# EAGLE design IFM_DuberFilter_ThroughHole_PCB (EAGLE 9.6.2)
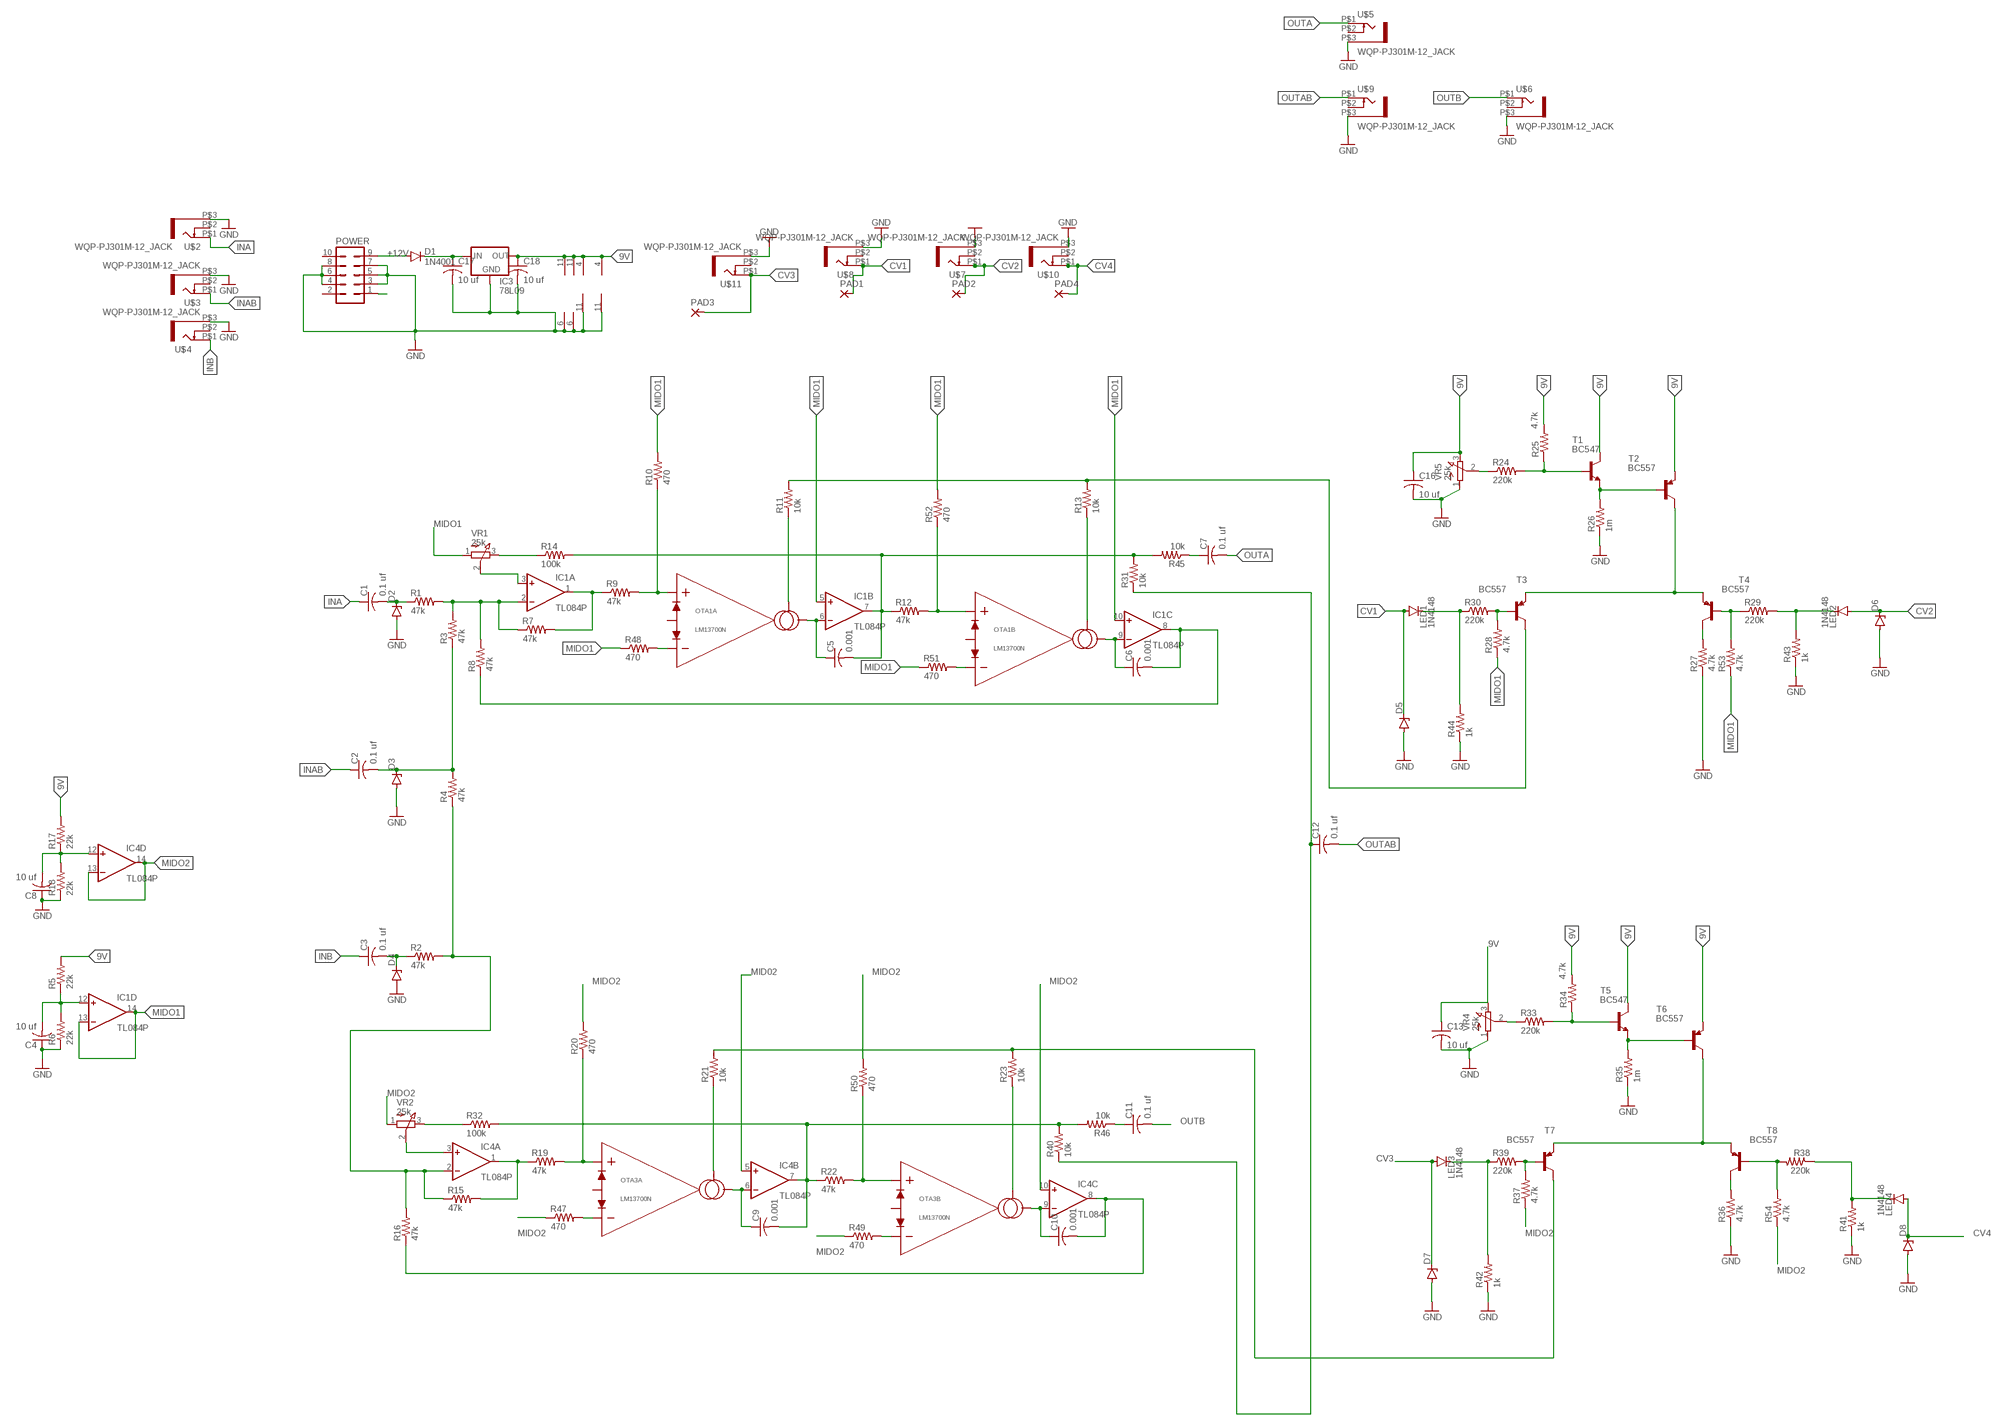
[diagram p0: schematic, sheet 1]

## Parts
C1  0.1 uf  C-US050-030X075  [C050-030X075]
C2  0.1 uf  C-US050-030X075  [C050-030X075]
C3  0.1 uf  C-US050-030X075  [C050-030X075]
C4  10 uf  C-US050-030X075  [C050-030X075]
C5  0.001  C-US050-030X075  [C050-030X075]
C6  0.001  C-US050-030X075  [C050-030X075]
C7  0.1 uf  C-US050-030X075  [C050-030X075]
C8  10 uf  C-US050-030X075  [C050-030X075]
C9  0.001  C-US050-030X075  [C050-030X075]
C10  0.001  C-US050-030X075  [C050-030X075]
C11  0.1 uf  C-US050-030X075  [C050-030X075]
C12  0.1 uf  C-US050-030X075  [C050-030X075]
C13  10 uf  C-US050-030X075  [C050-030X075]
C16  10 uf  C-US050-030X075  [C050-030X075]
C17  10 uf  C-US050-030X075  [C050-030X075]
C18  10 uf  C-US050-030X075  [C050-030X075]
D1  1N4001  1N4004  [DO41-10]
D2  ZENER-DIODEDO34-7  [DO34Z7]
D3  ZENER-DIODEDO34-7  [DO34Z7]
D4  ZENER-DIODEDO34-7  [DO34Z7]
D5  ZENER-DIODEDO34-7  [DO34Z7]
D6  ZENER-DIODEDO34-7  [DO34Z7]
D7  ZENER-DIODEDO34-7  [DO34Z7]
D8  ZENER-DIODEDO34-7  [DO34Z7]
IC1  TL084P  [DIL14]
IC3  78L09  78LXX  [78LXX]
IC4  TL084P  [DIL14]
LED1  1N4148  1N4148DO35-7  [DO35-7]
LED2  1N4148  1N4148DO35-7  [DO35-7]
LED3  1N4148  1N4148DO35-7  [DO35-7]
LED4  1N4148  1N4148DO35-7  [DO35-7]
OTA1  LM13700N  [DIP16]
OTA3  LM13700N  [DIP16]
PAD1  SMD2  [SMD1,27-2,54]
PAD2  SMD2  [SMD1,27-2,54]
PAD3  SMD2  [SMD1,27-2,54]
PAD4  SMD2  [SMD1,27-2,54]
POWER  10_PIN_HEADER  [MA05-2]
R1  47k  R-US_0204/7  [0204/7]
R2  47k  R-US_0204/7  [0204/7]
R3  47k  R-US_0204/7  [0204/7]
R4  47k  R-US_0204/7  [0204/7]
R5  22k  R-US_0204/7  [0204/7]
R6  22k  R-US_0204/7  [0204/7]
R7  47k  R-US_0204/7  [0204/7]
R8  47k  R-US_0204/7  [0204/7]
R9  47k  R-US_0204/7  [0204/7]
R10  470  R-US_0204/7  [0204/7]
R11  10k  R-US_0204/7  [0204/7]
R12  47k  R-US_0204/7  [0204/7]
R13  10k  R-US_0204/7  [0204/7]
R14  100k  R-US_0204/7  [0204/7]
R15  47k  R-US_0204/7  [0204/7]
R16  47k  R-US_0204/7  [0204/7]
R17  22k  R-US_0204/7  [0204/7]
R18  22k  R-US_0204/7  [0204/7]
R19  47k  R-US_0204/7  [0204/7]
R20  470  R-US_0204/7  [0204/7]
R21  10k  R-US_0204/7  [0204/7]
R22  47k  R-US_0204/7  [0204/7]
R23  10k  R-US_0204/7  [0204/7]
R24  220k  R-US_0204/7  [0204/7]
R25  4.7k  R-US_0204/7  [0204/7]
R26  1m  R-US_0204/7  [0204/7]
R27  4.7k  R-US_0204/7  [0204/7]
R28  4.7k  R-US_0204/7  [0204/7]
R29  220k  R-US_0204/7  [0204/7]
R30  220k  R-US_0204/7  [0204/7]
R31  10k  R-US_0204/7  [0204/7]
R32  100k  R-US_0204/7  [0204/7]
R33  220k  R-US_0204/7  [0204/7]
R34  4.7k  R-US_0204/7  [0204/7]
R35  1m  R-US_0204/7  [0204/7]
R36  4.7k  R-US_0204/7  [0204/7]
R37  4.7k  R-US_0204/7  [0204/7]
R38  220k  R-US_0204/7  [0204/7]
R39  220k  R-US_0204/7  [0204/7]
R40  10k  R-US_0204/7  [0204/7]
R41  1k  R-US_0204/7  [0204/7]
R42  1k  R-US_0204/7  [0204/7]
R43  1k  R-US_0204/7  [0204/7]
R44  1k  R-US_0204/7  [0204/7]
R45  10k  R-US_0204/7  [0204/7]
R46  10k  R-US_0204/7  [0204/7]
R47  470  R-US_0204/7  [0204/7]
R48  470  R-US_0204/7  [0204/7]
R49  470  R-US_0204/7  [0204/7]
R50  470  R-US_0204/7  [0204/7]
R51  470  R-US_0204/7  [0204/7]
R52  470  R-US_0204/7  [0204/7]
R53  4.7k  R-US_0204/7  [0204/7]
R54  4.7k  R-US_0204/7  [0204/7]
T1  BC547  [TO92]
T2  BC557  BC557A-PNP-TO92-EBC  [TO92-EBC]
T3  BC557  BC557A-PNP-TO92-EBC  [TO92-EBC]
T4  BC557  BC557A-PNP-TO92-EBC  [TO92-EBC]
T5  BC547  [TO92]
T6  BC557  BC557A-PNP-TO92-EBC  [TO92-EBC]
T7  BC557  BC557A-PNP-TO92-EBC  [TO92-EBC]
T8  BC557  BC557A-PNP-TO92-EBC  [TO92-EBC]
U$2  WQP-PJ301M-12_JACK  [WQP-PJ301M-12_JACK]
U$3  WQP-PJ301M-12_JACK  [WQP-PJ301M-12_JACK]
U$4  WQP-PJ301M-12_JACK  [WQP-PJ301M-12_JACK]
U$5  WQP-PJ301M-12_JACK  [WQP-PJ301M-12_JACK]
U$6  WQP-PJ301M-12_JACK  [WQP-PJ301M-12_JACK]
U$7  WQP-PJ301M-12_JACK  [WQP-PJ301M-12_JACK]
U$8  WQP-PJ301M-12_JACK  [WQP-PJ301M-12_JACK]
U$9  WQP-PJ301M-12_JACK  [WQP-PJ301M-12_JACK]
U$10  WQP-PJ301M-12_JACK  [WQP-PJ301M-12_JACK]
U$11  WQP-PJ301M-12_JACK  [WQP-PJ301M-12_JACK]
VR1  25k  EVUF3L  [EVUFXL]
VR2  25k  EVUF3L  [EVUFXL]
VR4  25k  EVUF3L  [EVUFXL]
VR5  25k  EVUF3L  [EVUFXL]

## Nets
9V: C13.1 C16.1 C18.1 IC1.4(P:V+) IC3.OUT IC4.4(P:V+) OTA1.11(PWR:VCC) OTA3.11(PWR:VCC) R5.2 R17.2 R25.2 R34.2 T1.3(C) T2.E T5.3(C) T6.E VR4.3(E) VR5.3(E)
+12V [power]: C17.1 D1.C IC3.IN
-12V [power]: POWER.1
CV1: D5.C LED1.A PAD1.1(P) U$8.P$1
CV2: D6.C LED2.A PAD2.1(P) U$7.P$1
CV3: D7.C LED3.A PAD3.1(P) U$11.P$1
CV4: D8.C LED4.A PAD4.1(P) U$10.P$1
GND: C4.1 C8.1 C13.2 C16.2 C17.2 C18.2 D2.A D3.A D4.A D5.A D6.A D7.A D8.A IC1.11(P:V-) IC3.GND IC4.11(P:V-) OTA1.6(PWR:VEE) OTA3.6(PWR:VEE) POWER.3 POWER.4 POWER.5 POWER.6 POWER.7 POWER.8 R6.1 R18.1 R26.1 R27.1 R35.1 R36.1 R41.1 R42.1 R43.1 R44.1 U$2.P$3 U$3.P$3 U$4.P$3 U$5.P$3 U$6.P$3 U$7.P$3 U$8.P$3 U$9.P$3 U$10.P$3 U$11.P$3 VR4.1(A) VR5.1(A)
INA: C1.1 U$2.P$1
INAB: C2.1 U$3.P$1
INB: C3.1 U$4.P$1
MID02: IC4.5(B:+IN)
MIDO1: IC1.5(B:+IN) IC1.10(C:+IN) IC1.13(D:-IN) IC1.14(D:OUT) R10.2 R28.1 R48.1 R51.1 R52.2 R53.1 VR1.1(A)
MIDO2: IC4.10(C:+IN) IC4.13(D:-IN) IC4.14(D:OUT) R20.2 R37.1 R47.1 R49.1 R50.2 R54.1 VR2.1(A)
N$1: C3.2 D4.C R2.1
N$2: C1.2 D2.C R1.1
N$3: C2.2 D3.C R3.1 R4.2
N$4: IC4.2(A:-IN) R2.2 R4.1 R15.1 R16.2
N$5: IC1.2(A:-IN) R1.2 R3.2 R7.1 R8.2
N$6: OTA1.16(B:IABC) R13.1
N$7: C4.2 IC1.12(D:+IN) R5.1 R6.2
N$8: R14.1 VR1.3(E)
N$9: OTA1.13(B:IN-) R51.2
N$10: IC4.1(A:OUT) R15.2 R19.1
N$11: IC1.1(A:OUT) R7.2 R9.1
N$12: OTA1.3(A:IN+) R9.2 R10.1
N$13: C5.1 IC1.6(B:-IN) OTA1.5(A:IOUT)
N$14: OTA1.1(A:IABC) R11.1
N$15: C5.2 IC1.7(B:OUT) R12.1 R14.2 R31.2 R45.2
N$16: R29.1 R53.2 T4.B
N$17: R11.2 R13.2 T3.C
N$18: C6.1 IC1.9(C:-IN) OTA1.12(B:IOUT)
N$19: C6.2 IC1.8(C:OUT) R8.1
N$20: IC1.3(A:+IN) VR1.2(S)
N$21: R24.1 VR5.2(S)
N$22: OTA1.14(B:IN+) R12.2 R52.1
N$23: OTA3.3(A:IN+) R19.2 R20.1
N$24: C8.2 IC4.12(D:+IN) R17.1 R18.2
N$25: C9.1 IC4.6(B:-IN) OTA3.5(A:IOUT)
N$26: OTA3.1(A:IABC) R21.1
N$27: C9.2 IC4.7(B:OUT) R22.1 R32.2 R40.2 R46.2
N$28: OTA3.16(B:IABC) R23.1
N$29: R21.2 R23.2 T7.C
N$30: R32.1 VR2.3(E)
N$31: C10.1 IC4.9(C:-IN) OTA3.12(B:IOUT)
N$32: C10.2 IC4.8(C:OUT) R16.1
N$33: D1.A POWER.9
N$34: IC4.3(A:+IN) VR2.2(S)
N$35: OTA1.4(A:IN-) R48.2
N$36: R33.2 R34.1 T5.2(B)
N$37: R33.1 VR4.2(S)
N$38: R24.2 R25.1 T1.2(B)
N$39: LED2.C R29.2 R43.2
N$40: R26.2 T1.1(E) T2.B
N$41: T2.C T3.E T4.E
N$42: R35.2 T5.1(E) T6.B
N$43: R27.2 T4.C
N$44: C12.1 R31.1 R40.1
N$45: R28.2 R30.2 T3.B
N$47: C11.1 R46.1
N$49: LED1.C R30.1 R44.2
N$50: T6.C T7.E T8.E
N$51: R36.2 T8.C
N$52: R38.2 R54.2 T8.B
N$53: R37.2 R39.2 T7.B
N$54: LED4.C R38.1 R41.2
N$55: OTA3.4(A:IN-) R47.2
N$56: OTA3.13(B:IN-) R49.2
N$57: OTA3.14(B:IN+) R22.2 R50.1
N$58: LED3.C R39.1 R42.2
N$66: C7.1 R45.1
OUTA: C7.2 U$5.P$1
OUTAB: C12.2 U$9.P$1
OUTB: C11.2 U$6.P$1
Unconnected: OTA1.2(A:BIAS) OTA1.7(BUFA:IN) OTA1.8(BUFA:OUT) OTA1.9(BUFB:OUT) OTA1.10(BUFB:IN) OTA1.15(B:BIAS) OTA3.2(A:BIAS) OTA3.7(BUFA:IN) OTA3.8(BUFA:OUT) OTA3.9(BUFB:OUT) OTA3.10(BUFB:IN) OTA3.15(B:BIAS) POWER.2 POWER.10 U$2.P$2 U$3.P$2 U$4.P$2 U$5.P$2 U$6.P$2 U$7.P$2 U$8.P$2 U$9.P$2 U$10.P$2 U$11.P$2

## Library data of the parts
C1-C13 C16-C18 = rcl:C-US: CAPACITOR, American symbol; SPICEPREFIX: C
D1 = diode:1N4004: DIODE general purpose rectifier, 1 A
D2 D4-D8 = diode:ZENER-DIODE: Z-Diode
D3 = diode:ZENER-DIODE: Z-Diode; SPICEPREFIX: D
IC1 IC4 = linear:TL084: OP AMP
IC3 = v-reg:78LXX: VOLTAGE REGULATOR
LED1 LED3 = diode:1N4148: DIODE high speed (Philips); SPICEPREFIX: L
LED2 LED4 = diode:1N4148: DIODE high speed (Philips)
OTA1 OTA3 = OTAs:LM13700: Dual OTA with linearizing diode and output buffers - 2MHz open-loop bandwidth - Linearizing diodes reduces distortion at higher differential input voltages - Darlington output buffers enables low-impedance output LM13700 or LM13600 The LM13700 differs from the LM13600 in that the 13700's output buffers are biased independently from the transconductance amplifier, allowing superior performance in audio applications. Originally released by National Semiconductor Manufactured by Texas Instruments.
PAD1-PAD4 = wirepad:SMD2: SMD PAD
POWER = TomW:10_PIN_HEADER: PIN HEADER; OC_FARNELL: unknown; OC_NEWARK: unknown
R1-R54 = rcl:R-US_: RESISTOR, American symbol; SPICEPREFIX: R
T1 T5 = transistor:BC547: NPN TRANSISTOR
T2-T4 T6-T8 = transistor:*-PNP-: PNP Transistror
U$2-U$11 = thonkiconn:WQP-PJ301M-12_JACK
VR1 VR2 VR4 VR5 = pot:EVU: 9 mm Square Rotary Potentiometers Source: Panasonic

## Net classes
1 power: width 0.61 mm

## Board
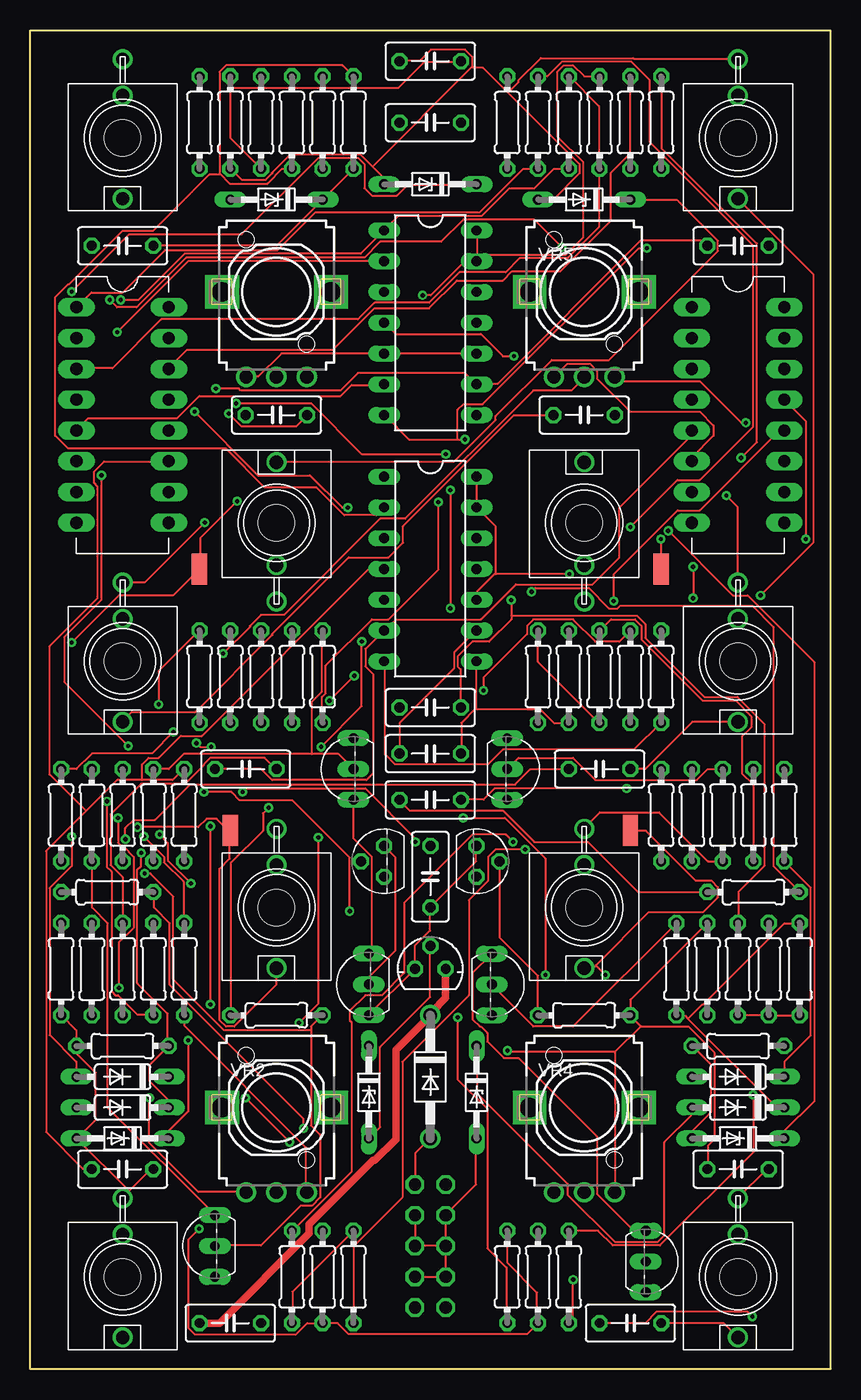
[diagram p1: board, top side]
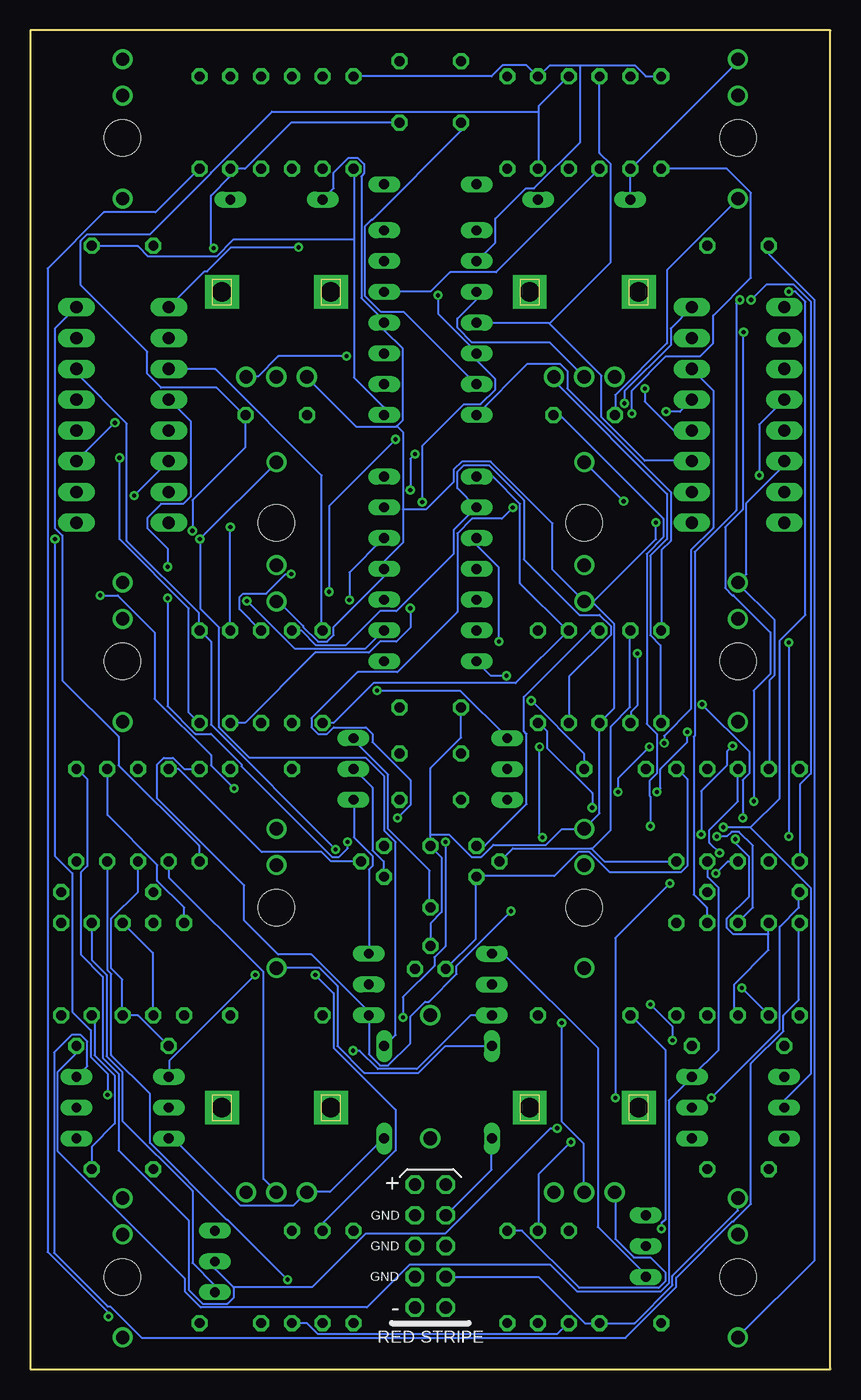
[diagram p2: board, bottom side, seen from below]

Size 66.04 x 110.49 mm. Coordinates in mm from the lower left corner, seen from the top.
Outline: 0,110.49 66.04,110.49 66.04,0 0,0 0,110.49
Copper layers (1*16): Top 0.035mm / dielectric 1.5mm / Bottom 0.035mm
Design rules "default": minimum track width 6mil, minimum drill 0.35mm, track to track 6mil, track to pad 6mil, pad to pad 6mil, via to via 6mil, smd to smd 6mil, copper to edge 40mil, drill to drill 6mil, minimum pad ring 10mil, minimum via ring 8mil, stop-mask expansion 4mil, vias tented up to drill 0mil, thermal gap 10mil
Holes 3 mm at 7.62,101.6 20.32,69.85 7.62,7.62 7.62,58.42 20.32,38.1 45.72,69.85 45.72,38.1 58.42,7.62 58.42,58.42 58.42,101.6

### Footprints (pad centres in the part's own frame; a part is rotated, then mirrored left to right if it is on the bottom)
C050-030X075 = drill 0.813 octagon: 1 -2.54,0; 2 2.54,0
DO41-10 = drill 1.118: A 5.08,0; C -5.08,0
DO34Z7 = drill 0.813 long: A 3.81,0; C -3.81,0
DIL14 = drill 0.813 long: 1 -7.62,-3.81; 2 -5.08,-3.81; 3 -2.54,-3.81; 4 0,-3.81; 5 2.54,-3.81; 6 5.08,-3.81; 7 7.62,-3.81; 8 7.62,3.81; 9 5.08,3.81; 10 2.54,3.81; 11 0,3.81; 12 -2.54,3.81; 13 -5.08,3.81; 14 -7.62,3.81
78LXX = drill 0.813 octagon: GND 0,1.905; IN 1.27,0; OUT -1.27,0
DO35-7 = drill 0.813 long: A 3.81,0; C -3.81,0
DIP16 = drill 1 long: 1 -3.81,0; 2 -3.81,-2.54; 3 -3.81,-5.08; 4 -3.81,-7.62; 5 -3.81,-10.16; 6 -3.81,-12.7; 7 -3.81,-15.24; 8 -3.81,-17.78; 9 3.81,-17.78; 10 3.81,-15.24; 11 3.81,-12.7; 12 3.81,-10.16; 13 3.81,-7.62; 14 3.81,-5.08; 15 3.81,-2.54; 16 3.81,0
SMD1,27-2,54 = smd 1.27 x 2.54: 1 0,0
MA05-2 = drill 1.016 octagon: 1 -5.08,-1.27; 2 -5.08,1.27; 3 -2.54,-1.27; 4 -2.54,1.27; 5 0,-1.27; 6 0,1.27; 7 2.54,-1.27; 8 2.54,1.27; 9 5.08,-1.27; 10 5.08,1.27
0204/7 = drill 0.813 octagon: 1 -3.81,0; 2 3.81,0
TO92 = drill 0.813 octagon: 1 1.27,0; 2 0,1.905; 3 -1.27,0
TO92-EBC = drill 0.813 long: B 0,-1.27; C 2.54,-1.27; E -2.54,-1.27
WQP-PJ301M-12_JACK = drill 1.1: P$1 0,5; P$2 0,-3.5; P$3 0,-6.5
EVUFXL = drill 1.1 pad 1.676: 1 -2.5,-7; 2 0,-7; 3 2.5,-7 | drill 1.6 pad 2.8 square: M1 4.5,0; M2 -4.5,0

### Placement (x,y rotation side)
C1  20.32,78.74 0 top
C2  45.72,78.74 0 top
C3  7.62,92.71 0 top
C4  33.02,107.95 0 top
C5  33.02,102.87 0 top
C6  58.42,92.71 0 top
C7  33.02,46.99 0 top
C8  33.02,54.61 0 top
C9  17.78,49.53 0 top
C10  33.02,50.8 0 top
C11  49.53,3.81 0 top
C12  46.99,49.53 0 top
C13  58.42,16.51 0 top
C16  7.62,16.51 0 top
C17  16.51,3.81 0 top
C18  33.02,40.64 90 top
D1  33.02,24.13 270 top
D2  7.62,19.05 180 top
D3  58.42,19.05 180 top
D4  20.32,96.52 180 top
D5  45.72,96.52 180 top
D6  33.02,97.79 180 top
D7  36.83,22.86 270 top
D8  27.94,22.86 270 top
IC1  33.02,86.36 270 top
IC3  33.02,33.02 0 top
IC4  33.02,66.04 270 top
LED1  7.62,24.13 180 top
LED2  7.62,21.59 180 top
LED3  58.42,21.59 180 top
LED4  58.42,24.13 180 top
OTA1  7.62,87.63 0 top
OTA3  58.42,87.63 0 top
PAD1  13.97,66.04 0 top
PAD2  16.51,44.45 0 top
PAD3  52.07,66.04 0 top
PAD4  49.53,44.45 0 top
POWER  33.02,10.16 90 bottom
R1  13.97,102.87 90 top
R2  26.67,102.87 90 top
R3  24.13,102.87 90 top
R4  21.59,102.87 90 top
R5  19.05,102.87 90 top
R6  16.51,102.87 90 top
R7  10.16,33.02 90 top
R8  39.37,102.87 90 top
R9  44.45,102.87 90 top
R10  46.99,102.87 90 top
R11  41.91,102.87 90 top
R12  49.53,102.87 90 top
R13  49.53,57.15 90 top
R14  13.97,57.15 90 top
R15  21.59,57.15 90 top
R16  44.45,57.15 90 top
R17  55.88,33.02 90 top
R18  58.42,33.02 90 top
R19  41.91,57.15 90 top
R20  46.99,57.15 90 top
R21  2.54,45.72 90 top
R22  52.07,57.15 90 top
R23  52.07,45.72 90 top
R24  16.51,57.15 90 top
R25  12.7,45.72 90 top
R26  19.05,57.15 90 top
R27  5.08,45.72 270 top
R28  24.13,57.15 90 top
R29  7.62,45.72 90 top
R30  10.16,45.72 90 top
R31  5.08,33.02 270 top
R32  12.7,33.02 90 top
R33  54.61,45.72 90 top
R34  45.72,29.21 0 top
R35  57.15,45.72 90 top
R36  60.96,33.02 90 top
R37  59.69,45.72 90 top
R38  62.23,45.72 90 top
R39  53.34,33.02 90 top
R40  7.62,33.02 90 top
R41  2.54,33.02 90 top
R42  63.5,33.02 90 top
R43  7.62,26.67 0 top
R44  58.42,26.67 0 top
R45  59.69,39.37 0 top
R46  52.07,102.87 90 top
R47  21.59,7.62 90 top
R48  24.13,7.62 90 top
R49  44.45,7.62 90 top
R50  26.67,7.62 90 top
R51  41.91,7.62 90 top
R52  39.37,7.62 90 top
R53  20.32,29.21 0 top
R54  6.35,39.37 0 top
T1  29.21,41.91 90 top
T2  26.67,31.75 90 top
T3  25.4,49.53 90 top
T4  13.97,10.16 90 top
T5  36.83,41.91 270 top
T6  40.64,49.53 270 top
T7  39.37,31.75 270 top
T8  52.07,8.89 270 top
U$2  7.62,101.6 180 top
U$3  7.62,58.42 180 top
U$4  7.62,7.62 180 top
U$5  58.42,101.6 180 top
U$6  58.42,7.62 180 top
U$7  20.32,38.1 180 top
U$8  20.32,69.85 0 top
U$9  58.42,58.42 180 top
U$10  45.72,38.1 180 top
U$11  45.72,69.85 0 top
VR1  20.32,88.9 0 top
VR2  20.32,21.59 0 top
VR4  45.72,21.59 0 top
VR5  45.72,88.9 0 top

### Tracks (layer width: path | path; a pad name or v marks a point on that pad's centre or on a via)
9V  (via drill 0.35)
  Top 0.152: v59.05,78.11 58.67,78.11 55.24,81.53 48.54,81.53 48.23,81.84 VR5.3 | v39.93,83.59 39.01,83.59 37.19,85.42 30.18,85.42 29.26,86.33 IC1.4 | R17.2 49.53,30.48 R34.2 49.53,29.18 50.41,28.31 | 50.41,28.31 50.44,28.27 54.33,28.27 56.46,26.14 56.46,18.97 55.93,18.44 55.93,16.54 C13.1 | 50.41,28.31 48.27,26.18 | 48.27,26.18 48.23,26.14 48.23,14.63 VR4.3 | T2.E 27.96,29.26 31.7,32.99 IC3.OUT 31.77,33.07 31.77,34.98 32.99,36.2 32.99,38.1 | 32.99,38.1 36.8,41.91 36.8,43.13 T5.3 | 32.99,38.1 C18.1 | v39.4,26.29 39.47,26.21 48.23,26.21 48.27,26.18 | 4.61,46.06 7.16,48.62 9.22,48.62 | 4.61,46.06 1.29,42.75 1.29,19.58 4.34,16.54 5.03,16.54 C16.1 | 9.22,48.62 11.73,48.62 12.65,49.53 R25.2 | 9.22,48.62 9.22,49.91 9.75,50.44 10.59,50.44 12.42,52.27 14.17,52.27 27.89,65.99 29.18,65.99 IC4.4 | 4.61,46.06 1.6,49.07 1.6,59.66 5.56,63.63 5.56,72.85 5.26,73.15 5.26,74.07 6.1,74.91 11.43,74.91 OTA1.11
  Bottom 0.152: v59.05,78.11 OTA3.11 | 23.2,86.3 18.9,81.99 18.9,78.56 15.32,74.98 11.43,74.98 OTA1.11 | 23.2,86.3 23.24,86.33 29.18,86.33 IC1.4 | R5.2 19.05,100.36 18.14,99.44 18.14,91.36 23.2,86.3 | v39.93,83.59 45.57,83.59 47.24,81.92 48.16,81.92 VR5.3 | IC3.OUT 29.26,35.51 29.26,40.62 T1.3 29.18,40.69 22.78,40.69 20.8,42.67 19.89,42.67 18.21,41 12.34,41 11.81,41.53 11.81,48.69 12.65,49.53 R25.2 | T6.E 39.32,52.05 39.32,51.89 36.5,49.07 36.5,44.58 33.07,41.15 33.07,38.1 C18.1 | v39.4,26.29 38.86,26.29 37.34,24.77 34.14,24.77 29.72,29.18 27.96,29.18 T2.E
+12V
  Top 0.61: C17.1 15.62,3.81 23.01,11.2 23.01,11.96 28.27,17.22 28.42,17.22 30.18,18.97 30.18,26.36 D1.C 33.15,29.49 34.29,30.63 IC3.IN
CV1  (via drill 0.35)
  Top 0.152: v17.07,71.63 14.02,68.58 14.02,66.06 PAD1.1 13.95,65.99 11.81,63.86 7.32,63.86 v3.43,59.97 | LED1.A 3.81,25.38 1.6,27.58 1.6,39.7 3.43,41.53 v3.43,43.97 | D5.C 49.53,96.47 53.42,96.47 56.77,93.12 56.77,92.28 47.78,83.29 43.05,83.29 38.41,78.64 38.41,78.33 34.98,74.91 20.34,74.91 U$8.P$1
  Bottom 0.152: v17.07,71.63 20.27,74.83 U$8.P$1 | v3.43,59.97 v3.43,43.97
CV2  (via drill 0.35)
  Top 0.152: U$7.P$1 20.27,33.07 20.27,31.7 16.84,28.27 16.15,28.27 15.62,28.8 15.62,41.3 16.46,42.14 16.46,44.42 PAD2.1 16.38,44.42 15.39,45.41 14.55,45.41 13.87,44.73 v8.84,44.73 | v3.43,88.92 8.15,93.65 17.45,93.65 23.77,99.97 27.05,99.97 27.58,99.44 27.58,97.46 28.19,96.85 30.25,96.85 31.17,97.77 36.8,97.77 D6.C
  Bottom 0.152: LED2.A 3.81,22.17 1.6,24.38 1.6,39.7 6.59,44.69 | 6.59,44.69 6.63,44.73 v8.84,44.73 | v3.43,88.92 2.9,88.92 2.06,88.09 2.06,62.26 4.19,60.12 4.19,47.09 6.59,44.69
CV3  (via drill 0.35)
  Top 0.152: v52.05,68.5 52.05,66.06 PAD3.1 | LED3.A 54.56,21.57 54.56,20.95 52.35,18.75 52.35,11.05 51.82,10.52 48.23,10.52 44.35,14.4 44.35,15.32 36.88,22.78 36.88,26.67 D7.C
  Bottom 0.152: U$11.P$1 45.72,74.83 v52.05,68.5 51.97,68.5 51.97,62.71 50.44,61.19 50.44,52.96 47.93,50.44 38.33,50.44 36.8,48.92 36.8,44.42 35.89,43.51 35.89,27.58 36.8,26.67 D7.C
CV4  (via drill 0.35)
  Top 0.152: 46.67,33.34 46.48,33.15 45.72,33.15 U$10.P$1 | 46.67,33.34 51.05,37.72 55.55,37.72 56.77,38.94 56.77,39.78 56.24,40.31 54.94,40.31 50.83,44.42 49.53,44.42 PAD4.1 | 46.67,33.34 v47.47,32.54
  Bottom 0.152: v47.47,32.54 54.56,25.45 54.56,24.16 LED4.A | D8.C 31.77,26.67 33.98,24.46 38.48,24.46 40.69,26.67 40.69,31.62 42.22,33.15 45.72,33.15 U$10.P$1
GND  (via drill 0.35)
  Top 0.152: OTA3.6 54.63,74.98 54.63,75.29 56.39,77.04 56.39,77.88 55.24,79.02 49.53,79.02 46.79,81.76 46.79,82.37 46.18,82.98 44.35,82.98 43.28,81.92 VR5.1 | v57.45,72.08 58.37,71.17 58.37,64.92 U$9.P$3 | 28.23,99.25 27.2,100.28 21.49,100.28 19.96,98.75 19.96,98.68 19.43,98.15 17.45,98.15 16.54,99.06 R6.1 | 28.23,99.25 29.18,98.3 29.18,97.84 D6.A | 28.23,99.25 36.46,107.48 | 36.46,107.48 36.5,107.52 36.5,108.28 35.89,108.89 33.07,108.89 32.16,107.97 30.48,107.97 C4.1 | 39.43,105.35 37.34,107.44 36.5,107.44 36.46,107.48 | 39.43,105.35 45.34,99.44 45.34,98.68 43.2,96.55 41.91,96.55 D5.A | 39.43,105.35 40.31,106.22 40.31,106.38 42.14,108.2 49.76,108.2 49.84,108.13 58.37,108.13 U$5.P$3 | v14.4,69.88 9.45,64.92 U$3.P$3 | R35.1 55.93,41.91 51.89,45.95 47.02,45.95 45.72,44.65 U$10.P$3 | C13.2 60.96,16.46 60.73,16.46 58.45,14.17 U$6.P$3 | 60.96,29.18 58.45,29.18 R18.1 | 60.96,29.18 63.48,29.18 R42.1 | 60.96,29.18 R36.1 | D3.A 54.63,19.05 54.63,19.66 56.16,21.18 56.16,25.15 54.63,26.67 R44.1 | R41.1 2.59,29.18 3.81,27.96 R43.1 3.81,26.06 5.41,24.46 5.41,20.57 3.89,19.05 D2.A 8.15,14.71 | 8.15,14.71 7.62,14.17 U$4.P$3 8.15,14.71 | 8.15,14.71 9.91,16.46 10.13,16.46 C16.2 | POWER.3 POWER.4 POWER.6 34.29,10.21 | POWER.7 31.77,12.65 31.77,10.21 POWER.5 31.85,10.21 34.29,10.21 | D7.A 36.8,19.05 36.8,15.24 34.29,12.72 POWER.8 34.29,10.21 | IC3.GND 32.99,34.9 32.99,30.71 28.88,26.59 28.88,19.96 27.96,19.05 D8.A
  Bottom 0.152: U$11.P$3 45.72,63.32 45.49,63.32 43.51,61.34 43.51,61.27 42.29,60.05 41.53,60.05 41,60.58 41,61.27 36.88,65.38 36.88,65.99 IC4.11 36.8,66.06 36.8,66.67 35.28,68.2 35.28,70.94 | 35.78,77.84 35.81,77.8 39.17,77.8 43.2,81.84 VR5.1 | 35.78,77.84 35.28,78.33 35.28,84.2 36.8,85.72 36.8,86.33 IC1.11 36.88,86.41 36.88,86.56 38.71,88.39 38.71,98.45 38.48,98.68 38.48,99.44 39.01,99.97 39.78,99.97 41,98.75 41,97.46 41.91,96.55 D5.A | OTA3.6 v57.45,72.08 | 35.28,70.94 35.28,77.34 35.78,77.84 | D4.A 16.54,96.55 16.54,99.06 R6.1 16.46,99.06 7.62,107.9 U$2.P$3 | R27.1 5.03,49.53 5.03,56.84 4.65,57.23 4.65,61.87 7.62,64.85 U$3.P$3 6.93,65.61 6.93,71.48 3.81,74.6 OTA1.6 | U$8.P$3 20.27,63.32 19.66,63.32 17.83,61.49 17.83,54.56 R26.1 19.05,45.87 20.27,44.65 U$7.P$3 20.34,44.58 22.17,44.58 23.47,43.28 27.81,43.28 28.8,42.29 29.64,42.29 31.47,44.12 32.99,44.12 | IC3.GND 32.99,34.98 32.99,36.8 32.08,37.72 32.08,42.22 32.99,43.13 C18.2 32.99,43.2 32.99,44.12 | C8.1 30.48,52.12 32.99,49.61 32.99,44.12 | v14.4,69.88 14.4,68.5 19.58,63.32 U$8.P$3 | R44.1 54.63,26.67 57.15,29.18 58.37,29.18 R18.1 58.45,29.26 58.45,32.16 59.36,33.07 59.36,37.19 57.15,39.4 R35.1 | C13.2 60.96,18.36 59.05,20.27 59.05,24.23 60.73,25.91 60.73,28.96 60.96,29.18 R36.1 | POWER.3 24.08,7.62 20.27,3.81 C17.2 16.15,3.81 13.03,6.93 13.03,7.7 7.62,13.11 U$4.P$3 | D8.A 27.96,19.05 27.96,16.46 31.7,12.72 POWER.7 | D7.A 36.88,19.05 41.3,14.63 43.2,14.63 VR4.1 43.28,14.55 44.35,13.49 48.69,13.49 54.25,19.05 D3.A | 35.28,70.94 33.38,70.94 31.09,73.23 31.09,74.22 30.4,74.91 28.04,74.91 22.94,69.8 22.94,65.99 20.34,63.4 U$8.P$3
INA
  Bottom 0.152: C1.1 17.75,78.79 17.75,80.39 13.49,84.66 13.49,90.68 7.62,96.55 U$2.P$1
INAB
  Top 0.152: C2.1 43.13,78.72 39.93,78.72 30.79,69.57 30.79,68.2 29.57,66.98 26.29,66.98 19.96,60.66 19.96,60.58 13.64,54.25 8.38,54.25 7.62,53.49 U$3.P$1
INB
  Bottom 0.152: C3.1 5.03,92.66 5.03,91.97 1.29,88.24 1.29,8.99 7.62,2.67 U$4.P$1
MIDO1  (via drill 0.35)
  Top 0.152: IC1.10 IC1.5 20.73,83.82 18.82,81.92 17.83,81.92 VR1.1 | 36.88,91.97 36.88,93.95 IC1.14 | 36.88,91.97 36.88,91.44 IC1.13 | R10.2 45.72,106.68 44.81,107.59 44.04,107.59 43.51,107.06 43.51,101.73 45.64,99.59 45.64,93.42 44.2,91.97 36.88,91.97 | 36.88,91.97 IC1.13 | v32.38,88.62 33.07,88.62 35.89,91.44 IC1.13 | R52.2 39.4,11.43 39.4,8.76 41.83,6.33 41.83,3.81 R51.1 41,2.9 26.29,2.9 25.38,3.81 R48.1 22.86,3.81 21.95,2.9 13.56,2.9 13.03,3.43 13.03,10.67 v13.95,11.58 | v19.66,46.33 19.2,45.87 19.2,44.42 16.54,41.76 16.54,29.26 R53.1 | v33.68,71.55 33.68,65.99 29.57,61.87 28.19,61.87 24.38,58.06 24.38,55.78 24.08,55.47 24.08,53.34 R28.1
  Bottom 0.152: v32.38,88.62 32.38,87.1 29.26,83.97 29.26,83.82 IC1.5 29.18,83.82 29.18,83.21 27.66,81.69 27.66,80.85 28.88,79.63 30.25,79.63 33.68,76.2 v33.68,71.55 | v19.66,46.33 19.66,47.55 23.39,51.28 23.39,52.65 24.08,53.34 R28.1 | v13.95,11.58 13.95,12.04 13.64,12.34 13.64,26.36 16.46,29.18 R53.1
MIDO2  (via drill 0.35)
  Top 0.152: 38.37,65.65 38.41,65.68 38.41,69.57 36.88,71.09 IC4.13 36.88,71.17 36.88,73.61 IC4.14 | 38.37,65.65 36.88,64.16 36.88,63.55 IC4.10 | R37.1 59.66,41.91 59.66,48.23 58.75,49.15 58.75,52.2 59.51,52.96 59.51,53.87 58.22,55.17 55.47,55.17 50.44,60.2 50.44,61.34 49.91,61.87 47.93,61.87 47.02,60.96 R20.2 | v44.5,65.61 38.41,65.61 38.37,65.65 | R50.2 21.64,6.4 21.64,3.81 R47.1 | v9.83,22.4 9.83,18.67 13.87,14.63 17.75,14.63 VR2.1 | v44.81,7.39 44.81,4.12 44.5,3.81 R49.1
  Bottom 0.152: v44.5,65.61 44.96,65.61 46.56,64.01 48.46,64.01 48.77,63.7 48.77,62.71 47.02,60.96 R20.2 | R49.1 43.2,3.81 42.29,2.9 22.55,2.9 21.64,3.81 R47.1 | v9.83,22.4 4.19,28.04 4.19,36.5 2.59,38.1 2.59,39.32 R54.1 | R50.2 25.45,11.43 20.73,6.71 14.17,6.71 13.64,7.24 13.64,8 14.86,9.22 16.23,9.22 17.75,10.74 17.75,14.55 VR2.1 | v44.81,7.39 49.76,12.34 49.84,12.34 56.16,18.67 56.16,22.71 59.36,25.91 59.36,32.61 59.66,32.92 59.66,41.91 R37.1
N$1
  Top 0.152: C3.2 10.21,92.73 20.34,92.73 D4.C R2.1
N$2  (via drill 0.35)
  Top 0.152: D2.C 11.43,19.66 13.03,21.26 v13.03,27.13 | v14.86,44.81 v14.86,30.1 | v16.38,78.87 17.45,77.8 21.95,77.8 22.86,78.72 C1.2
  Bottom 0.152: v13.03,27.13 13.03,28.27 v14.86,30.1 | v14.86,44.81 14.86,47.24 14.94,47.32 14.94,48.54 14.33,49.15 14.33,52.43 15.16,53.26 15.16,67.28 13.79,68.66 13.79,70.18 22.33,78.72 22.86,78.72 C1.2 | R1.1 8.53,99.06 6.55,97.08 6.55,90.07 9.68,86.94 9.68,84.66 10.74,83.59 13.56,83.59 16.38,80.77 v16.38,78.87
N$3  (via drill 0.35)
  Top 0.152: v52.65,69.19 57.99,63.86 59.21,63.86 64.69,58.37 64.69,22.1 62.26,19.66 62.26,19.05 D3.C
  Bottom 0.152: 24.08,103.78 24.08,104.24 21.64,106.68 R4.2 | 24.08,103.78 24.08,99.06 R3.1 | v52.65,69.19 52.65,71.7 48.31,76.05 48.31,78.72 C2.2 48.39,78.72 50.67,81 55.24,81 56.39,82.14 56.39,83.97 61.87,89.46 61.87,93.12 61.34,93.65 56.16,93.65 51.13,98.68 51.13,98.75 46.1,103.78 24.08,103.78
N$4
  Top 0.152: R4.1 20.8,99.06 19.58,97.84 16.46,97.84 15.66,98.64 | 15.66,98.64 15.62,98.68 15.62,107.06 16.15,107.59 25.76,107.59 R2.2 | IC4.2 28.57,70.48 25.91,70.48 23.62,72.77 19.36,72.77 16.15,75.97 3.12,75.97 2.06,77.04 2.06,88.47 3.12,89.53 3.2,89.53 7.62,93.95 10.13,93.95 14.78,98.6 15.62,98.6 15.66,98.64
  Bottom 0.152: R15.1 21.57,53.34 21.57,57.15 18.14,60.58 18.14,61.34 19.05,62.26 20.73,62.26 25.3,66.83 25.3,71.7 28.19,74.6 30.25,74.6 30.79,74.07 30.79,72.69 IC4.2 29.26,71.09 31.09,69.27 31.09,67.28 35.81,62.56 37.19,62.56 40.01,59.74 42.44,59.74 43.66,60.96 R16.2
N$5  (via drill 0.35)
  Top 0.152: v6.33,46.86 6.33,41.45 6.71,41.07 6.71,31.17 7.01,30.86 7.24,30.86 8.84,29.26 10.13,29.26 R7.1 | v7.16,85.57 13.03,91.44 IC1.2
  Bottom 0.152: R1.2 15.24,106.68 16.15,107.59 20.65,107.59 | 20.65,107.59 23.16,107.59 24.08,106.68 R3.2 24.16,106.68 25.07,107.59 27.05,107.59 27.96,106.68 R8.2 | v6.33,46.86 6.33,56.01 4.95,57.38 4.95,60.81 8,63.86 8.08,63.86 8.69,64.47 8.69,69.49 7.24,70.94 7.24,85.5 v7.16,85.57 | 20.65,107.59 20.65,101.27 24.46,97.46 25.15,97.46 27.66,94.94 27.66,92.96 29.18,91.44 IC1.2
N$6  (via drill 0.35)
  Top 0.152: v34.67,72.54 v34.67,62.79 | v34.29,75.51 27.36,75.51 23.16,79.7 v16.99,79.7
  Bottom 0.152: R13.1 48.31,53.34 42.52,59.13 38.1,59.13 37.19,60.05 35.81,60.05 34.67,61.19 v34.67,62.79 | v34.67,72.54 34.67,75.13 v34.29,75.51 | v16.99,79.7 16.99,80.7 13.18,84.51 13.18,85.88 OTA1.16
N$7
  Top 0.152: 16.54,105.77 16.54,101.58 R5.1 | 16.54,105.77 16.54,106.68 R6.2 | 16.54,105.77 30.4,105.77 32.54,107.9 35.51,107.9 C4.2
  Bottom 0.152: R5.1 27.58,90.53 31.39,90.53 32.99,88.92 36.8,88.92 IC1.12
N$8
  Bottom 0.152: R14.1 14.02,53.34 14.02,59.74 14.86,60.58 14.86,67.13 13.49,68.5 13.49,72.24 22.78,81.53 22.78,81.84 VR1.3
N$9  (via drill 0.35)
  Top 0.152: v42.52,32.54 42.52,42.14 39.17,45.49 v35.74,45.49 | v26.21,71.09 25.76,71.09 23.09,73.76 18.82,73.76 v13.56,79.02
  Bottom 0.152: R51.2 41.91,12.04 35.89,18.06 35.89,21.41 41,26.52 41,31.01 v42.52,32.54 | v35.74,45.49 34.67,46.56 34.67,48.62 37.8,51.74 37.8,52.43 38.33,52.96 41,52.96 41.53,52.43 42.29,52.43 42.82,52.96 42.82,53.72 39.01,57.53 35.74,57.53 30.79,62.48 30.79,68.96 29.57,70.18 27.13,70.18 v26.21,71.09 | v13.56,79.02 12.42,79.02 OTA1.13
N$10
  Bottom 0.152: R19.1 41,53.34 37.72,56.62 25.98,56.62 21.64,60.96 R15.2 21.72,60.96 25.6,64.85 25.6,71.4 27.81,73.61 29.18,73.61 IC4.1
N$11  (via drill 0.35)
  Top 0.152: v7.47,88.24 8.91,88.24 12.72,92.05 27.28,92.05 IC1.1 30.4,95.17 37.26,95.17 39.55,97.46 41.6,97.46 43.2,99.06 R9.1
  Bottom 0.152: v7.47,88.24 7.77,87.94 7.77,70.87 11.2,67.44 11.2,52.27 11.28,52.2 11.28,39.17 10.21,38.1 10.21,36.88 R7.2
N$12
  Top 0.152: 46.94,99.06 46.94,104.24 44.5,106.68 R9.2 | 46.94,99.06 46.94,94.26 44.35,91.67 40.39,91.67 39.24,90.53 35.43,90.53 32.92,88.01 28.42,88.01 27.05,86.64 10.82,86.64 6.78,82.6 3.81,82.6 OTA1.3 | 46.94,99.06 R10.1
N$13
  Top 0.152: IC1.6 29.18,81.23 26.52,81.23 25.6,80.31 13.95,80.31 12.12,78.49 4.8,78.49 3.81,77.5 OTA1.5
  Bottom 0.152: C5.1 30.48,102.18 37.8,94.87 37.87,94.87 38.41,94.34 38.41,88.54 37.11,87.25 35.2,87.25 29.26,81.31 IC1.6
N$14
  Top 0.152: R11.1 40.69,99.06 37.11,95.48 23.55,95.48 20.42,92.35 11.12,92.35 7.62,88.85 5.03,88.85 OTA1.1
N$15  (via drill 0.35)
  Top 0.152: v7.32,31.47 7.32,35.2 8.53,36.42 8.53,42.29 7.7,43.13 7.54,43.13 7.24,43.43 v7.24,45.49 | v10.59,54.86 10.59,57.61 13.95,60.96 R14.2 | R45.2 61.34,41.53 61.34,61.27 59.59,63.02 48.69,63.02 48.46,62.79 47.78,62.79 46.1,64.47 41.68,64.47 v41.38,64.16 | 35.28,76.73 31.24,76.73 29.26,78.72 IC1.7 | 35.28,76.73 v35.89,76.73 | v50.9,92.51 50.22,92.51 37.34,79.63 35.74,79.63 35.28,79.17 35.28,76.73
  Bottom 0.152: v7.32,31.47 5.11,29.26 R31.2 | v7.24,45.49 7.24,48.62 6.71,49.15 6.71,50.98 v10.59,54.86 | C5.2 44.5,102.87 48.31,99.06 R12.1 49.53,98.45 51.13,96.85 51.13,92.73 v50.9,92.51 | v41.38,64.16 41.38,71.25 v35.89,76.73 | R14.2 13.95,60.96 13.95,67.59 13.18,68.35 13.18,72.39 21.72,80.92 21.72,82.37 22.33,82.98 24.99,82.98 29.18,78.79 IC1.7
N$16  (via drill 0.35)
  Top 0.152: 23.16,27.96 23.16,28.27 24.08,29.18 R53.2 | 23.16,27.96 23.16,20.12 23.93,19.36 23.93,14.17 23.24,13.49 22.33,13.49 19.05,10.21 15.24,10.21 T4.B | v9.45,40.92 9.91,40.92 11.81,39.01 11.81,32.16 16,27.96 23.16,27.96
  Bottom 0.152: R29.1 8.46,41.91 v9.45,40.92
N$17  (via drill 0.35)
  Top 0.152: v37.41,56.01 37.41,57.07 41,60.66 41,61.34 41.53,61.87 44.81,61.87 46.63,60.05 48.62,60.05 R13.2 | R11.2 42.67,106.68 43.89,107.9 49.61,107.9 51.13,106.38 51.13,101.27 59.66,92.73 59.66,77.8 55.24,73.38 53.42,73.38 v49.53,69.49
  Bottom 0.152: v37.41,56.01 30.56,56.01 26.67,52.12 T3.C | R13.2 v49.53,69.49
N$18  (via drill 0.35)
  Top 0.152: C6.1 55.47,93.12 50.37,93.12 38.56,81.31 36.88,81.31 IC1.9 35.89,82.22 27.05,82.22 25.6,80.77 17.37,80.77 17.22,80.92 v15.32,80.92
  Bottom 0.152: v15.32,80.92 15.32,79.86 12.95,77.5 11.43,77.5 OTA1.12
N$19
  Bottom 0.152: 39.32,93.19 39.32,99.06 R8.1 | 39.32,93.19 39.32,81.84 36.88,79.4 36.88,78.79 IC1.8 | 39.32,93.19 49.3,93.19 50.67,91.82 56.31,91.82 57.15,92.66 60.96,92.66 C6.2
N$20
  Bottom 0.152: IC1.3 29.26,88.85 29.26,88.24 30.79,86.72 30.79,85.95 29.57,84.73 23.16,84.73 20.34,81.92 VR1.2
N$21  (via drill 0.35)
  Top 0.152: v15.93,59.05 18.14,61.27 18.14,61.34 19.05,62.26 20.95,62.26 28.88,70.18 30.94,70.18 41.53,80.77 44.65,80.77 45.72,81.84 VR5.2
  Bottom 0.152: v15.93,59.05 15.93,54.79 16.46,54.25 16.46,53.34 R24.1
N$22  (via drill 0.35)
  Top 0.152: v35.28,29.03 35.28,23.93 37.72,21.49 37.72,9.98 39.32,8.38 39.32,3.81 R52.1 | v31.77,43.51 31.77,43.81 27.66,47.93 17.83,47.93 v17.53,47.62 | v14.94,51.36 14.02,51.36 v13.72,51.66 | R12.2 49.53,100.36 47.93,98.75 47.93,94.79 43.74,90.6 39.78,90.6 39.01,89.84 35.2,89.84 32.92,87.55 28.42,87.55 24.99,84.12 12.95,84.12 11.43,82.6 OTA1.14
  Bottom 0.152: v35.28,29.03 35.28,30.71 32.69,33.3 32.69,33.98 31.77,34.9 v31.77,43.51 | v17.53,47.62 17.53,48.77 v14.94,51.36 | v13.72,51.66 13.72,52.27 11.51,54.48 11.51,67.59 9.68,69.42 9.68,80.77 11.43,82.53 OTA1.14
N$23
  Top 0.152: R19.2 41.91,58.37 46.94,53.34 R20.1
  Bottom 0.152: R19.2 41.99,61.04 41.99,73.76 50.75,82.53 54.56,82.53 OTA3.3
N$24  (via drill 0.35)
  Top 0.152: v39.7,63.48 39.7,62.18 | 39.7,62.18 39.7,61.87 37.87,60.05 36.5,60.05 35.28,58.83 35.28,57.99 35.51,57.76 35.51,54.63 C8.2 | 39.7,62.18 50.06,62.18 50.75,61.49 50.75,60.35 55.63,55.47 58.37,55.47 60.58,53.26 60.58,41.53 58.45,39.4 58.45,36.88 R18.2
  Bottom 0.152: R17.1 55.93,29.26 55.93,34.37 58.37,36.8 R18.2 | v39.7,63.48 39.7,65.76 36.88,68.58 IC4.12
N$25
  Top 0.152: C9.1 19.05,49.53 19.96,48.62 27.74,48.62 28.27,49.15 28.27,57.38 27.66,57.99 27.66,59.44 29.18,60.96 IC4.6 29.26,60.96 30.18,61.87 37.19,61.87 40.08,64.77 46.41,64.77 48.62,66.98 48.62,71.09 54.56,77.04 54.56,77.42 OTA3.5
N$26  (via drill 0.35)
  Top 0.152: v6.55,88.24 7.16,87.63 8.76,87.63 12.88,91.75 27.58,91.75 28.88,93.04 33.91,93.04 35.74,94.87 41.6,94.87 v43.89,92.58
  Bottom 0.152: v6.55,88.24 5.26,89.53 3.05,89.53 1.6,88.09 1.6,49.15 2.52,48.23 2.52,41.91 R21.1 | v43.89,92.58 49.45,92.58 51.44,90.6 51.66,90.6 54.63,87.63 OTA3.1
N$27  (via drill 0.35)
  Top 0.152: R40.2 7.62,40.62 6.63,41.6 6.63,45.8 9.14,48.31 12.8,48.31 14.33,49.84 14.33,49.91 14.86,50.44 19.36,50.44 20.27,49.53 C9.2 | v9.37,43.97 11.05,42.29 11.05,41.83 12.65,40.23 12.65,36.88 R32.2 | IC4.7 29.26,58.37 29.26,50.75 30.1,49.91 37.8,49.91 39.01,51.13 49.84,51.13 52.05,53.34 R22.1 | v58.67,75.21 59.97,76.5 59.97,92.89 52.12,100.74 52.12,106.68 R46.2 | v26.75,57.23 v24.69,55.17
  Bottom 0.152: v9.37,43.97 8.53,43.97 8.15,44.35 7.54,44.35 6.4,43.2 6.4,38.1 7.62,36.88 R40.2 | v58.67,75.21 58.67,68.5 52.96,62.79 52.96,54.18 52.12,53.34 R22.1 | v24.69,55.17 20.34,50.83 20.34,49.53 C9.2 | v26.75,57.23 28.04,57.23 29.18,58.37 IC4.7
N$28
  Bottom 0.152: R23.1 52.12,41.91 52.12,43.2 58.75,49.84 58.75,52.2 63.4,56.84 63.4,68.81 64.01,69.42 64.01,85.88 62.26,87.63 OTA3.16
N$29  (via drill 0.35)
  Top 0.152: R21.2 3.81,49.53 5.11,50.83 10.06,50.83 v11.81,52.58 | v14.33,47.62 16.61,47.62 17.3,46.94 21.64,46.94 26.36,42.22 v26.36,37.8
  Bottom 0.152: v11.81,52.58 11.81,51.74 14.02,49.53 14.02,47.93 v14.33,47.62 | v26.36,37.8 30.86,33.3 30.86,32.61 33.15,30.33 33.45,30.33 34.67,29.11 34.67,26.9 36.5,25.07 37.19,25.07 38.1,25.98 T7.C 38.1,29.49 42.82,34.21 45.57,34.21 48.39,37.03 48.39,39.93 55.55,47.09 55.55,49.91 55.02,50.44 54.25,50.44 53.34,49.53 R23.2
N$30
  Top 0.152: R32.1 12.72,29.18 12.72,28.35 22.78,18.29 22.78,14.63 VR2.3
N$31  (via drill 0.35)
  Top 0.152: C10.1 30.48,53.34 34.98,57.84 34.98,59.13 36.8,60.96 IC4.9 | v48.16,63.4 48.16,65.61 53.42,70.87 55.24,70.87 61.8,77.42 62.18,77.42 OTA3.12
  Bottom 0.152: v48.16,63.4 44.2,59.44 38.41,59.44 36.88,60.96 IC4.9
N$32
  Top 0.152: 36.77,54.52 36.8,54.56 36.8,58.37 IC4.8 | 36.77,54.52 35.59,53.34 35.59,50.83 C10.2 | R16.1 43.2,53.34 42.06,54.48 36.8,54.48 36.77,54.52
N$33
  Top 0.152: POWER.9 31.77,15.24 31.77,17.83 32.99,19.05 D1.A
N$34  (via drill 0.35)
  Top 0.152: v27.36,60.05 27.36,54.71 v24,51.36 | v23.77,43.89 23.77,30.18 v22.17,28.57
  Bottom 0.152: v27.36,60.05 27.36,66.14 29.18,67.97 29.18,68.58 IC4.3 | v24,51.36 24,44.12 v23.77,43.89 | v22.17,28.57 22.17,20.42 20.34,18.59 20.34,14.63 VR2.2
N$35  (via drill 0.35)
  Top 0.152: v17.75,22.4 v21.41,18.75 | v13.26,40.08 11.35,41.99 11.35,43.43 v10.67,44.12 | v8.08,51.44 2.82,56.69 2.82,60.43 5.87,63.48 v5.87,73.76
  Bottom 0.152: v21.41,18.75 24.08,16.08 24.08,11.43 R48.2 | v17.75,22.4 17.75,35.59 v13.26,40.08 | v10.67,44.12 10.67,47.7 8.53,49.84 8.53,50.98 v8.08,51.44 | v5.87,73.76 5.87,77.95 OTA1.4
N$36
  Top 0.152: R34.1 41.91,32.46 38.79,35.59 38.79,41.91 T5.2
  Bottom 0.152: R33.2 53.8,49.53 46.94,42.67 41.99,42.67 41.22,41.91 T5.2
N$37
  Bottom 0.152: R33.1 54.56,41.91 54.56,40.54 46.79,32.77 46.79,15.7 45.72,14.63 VR4.2
N$38
  Bottom 0.152: R25.1 18.67,41.91 19.7,42.94 | 19.7,42.94 19.74,42.98 26.21,42.98 27.28,41.91 T1.2 | 19.7,42.94 18.14,44.5 18.14,53.03 16.54,54.63 16.54,60.96 R24.2
N$39  (via drill 0.35)
  Top 0.152: LED2.C 11.43,22.17 9.83,23.77 9.83,25.07 R43.2 11.35,26.67 11.35,29.34 8.84,31.85 8.84,41.22 9.14,41.53 v9.14,42.6
  Bottom 0.152: R29.2 7.62,46.86 9.98,44.5 9.98,43.43 v9.14,42.6
N$40
  Top 0.152: T1.1 30.1,42.29 30.1,34.52 27.96,32.38 27.96,31.77 T2.B
  Bottom 0.152: R26.2 19.81,60.96 25.3,55.47 25.3,52.65 25.07,52.43 25.07,46.63 28.5,43.2 29.18,43.2 T1.1
N$41
  Top 0.152: T3.E 26.67,43.81 28.19,42.29 28.19,34.52 27.96,34.29 T2.C
  Bottom 0.152: T4.E 15.24,7.77 19.2,11.73 19.2,26.52 26.98,34.29 T2.C
N$42
  Top 0.152: R35.2 55.93,49.53 55.02,48.62 46.63,48.62 44.81,50.44 40.31,50.44 39.4,49.53 T6.B
  Bottom 0.152: T5.1 36.88,40.69 36.88,41.91 37.8,42.82 37.8,48.01 39.32,49.53 T6.B
N$43
  Top 0.152: R27.2 5.11,41.91 5.11,38.1 6.4,36.8 6.4,21.57 15.24,12.72 T4.C
N$44  (via drill 0.35)
  Top 0.152: C12.1 41.3,49.53 40.01,48.23 13.18,48.23 10.29,45.34 8.53,45.34 7.85,44.65 v7.85,43.74
  Bottom 0.152: 5.11,35.89 5.11,34.59 7.92,31.77 7.92,29.57 7.62,29.26 R40.1 | 5.11,35.89 5.11,36.8 R31.1 | v7.85,43.74 7.85,43.43 6.71,42.29 6.71,39.01 8.53,37.19 8.53,36.42 8,35.89 5.11,35.89
N$45
  Top 0.152: R30.2 11.43,49.53 12.65,50.75 23.24,50.75 | 23.24,50.75 25.45,50.75 T3.B | 23.24,50.75 23.24,55.09 24.08,55.93 24.08,60.96 R28.2
N$47  (via drill 0.35)
  Top 0.152: C11.1 50.75,3.81 51.66,4.72 59.21,4.72 v59.59,4.34
  Bottom 0.152: v59.59,4.34 59.59,4.65 64.62,9.68 64.62,90.83 59.97,95.48 55.7,95.48 52.12,99.06 R46.1
N$49
  Bottom 0.152: R30.1 10.13,41.91 10.13,40.62 9.22,39.7 9.22,26.36 11.43,24.16 LED1.C 11.43,24.08 13.34,22.17 13.34,7.09 14.02,6.4 20.88,6.4 23.09,8.61 34.75,8.61 38.25,5.11 51.97,5.11 53.26,6.4 53.26,7.47 63.78,17.98 63.78,24.54 62.26,26.06 62.26,26.67 R44.2
N$50
  Top 0.152: T8.E 49.84,11.43 46.79,14.48 46.79,19.2 40.31,25.68 39.09,25.68 37.72,27.05 37.72,27.74 37.19,28.27 37.11,28.27 36.5,28.88 36.5,32.69 T7.E
  Bottom 0.152: T7.E 38.1,41.22 37.8,41.53 37.8,42.37 39.32,43.89 39.32,46.94 T6.C
N$51
  Bottom 0.152: R36.2 60.96,33.76 59.74,32.54 59.74,25.83 58.45,24.54 58.45,20.5 52.65,14.71 52.65,8.76 50.83,6.93 50.83,6.4 T8.C
N$52  (via drill 0.35)
  Top 0.152: v22.55,19.89 22.55,20.65 11.51,31.7 11.51,36.8 10.21,38.1 10.21,39.32 R54.2
  Bottom 0.152: 49.26,6.74 49.23,6.71 49.23,5.94 49.76,5.41 51.82,5.41 52.96,6.55 52.96,12.27 58.75,18.06 58.75,24.38 60.05,25.68 60.05,32.38 61.87,34.21 61.87,41 61.34,41.53 61.34,48.69 62.18,49.53 R38.2 | 49.26,6.74 50.75,8.23 50.75,8.84 T8.B | v22.55,19.89 23.09,19.89 31.77,11.2 38.33,11.2 42.75,6.78 49.23,6.78 49.26,6.74
N$53
  Top 0.152: T7.B 38.1,31.7 41.53,28.27 44.81,28.27 53.34,36.8 R39.2
  Bottom 0.152: R39.2 53.34,38.1 55.55,40.31 55.55,41.6 59.66,45.72 59.66,49.53 R37.2
N$54
  Top 0.152: LED4.C 62.26,24.16 62.26,25.38 64.39,27.51 64.39,39.78 62.26,41.91 R38.1
  Bottom 0.152: R41.2 2.59,36.8 2.59,30.48 3.89,29.18 3.89,27.89 6.55,25.22 6.55,13.64 8,12.19 8.08,12.19 12.72,7.54 12.72,6.78 16.92,2.59 56.84,2.59 59.44,5.18 59.66,5.18 64.08,9.6 64.08,26.14 62.64,27.58 61.87,27.58 61.34,27.05 61.34,24.99 62.18,24.16 LED4.C
N$55  (via drill 0.35)
  Top 0.152: v39.85,43.51 39.24,44.12 36.5,44.12 30.86,38.48 30.86,32.69 29.03,30.86 27.66,30.86 26.36,29.57 26.36,28.8 26.52,28.65 26.52,16.31 21.64,11.43 R47.2 | v54.71,66.22 v54.71,63.63
  Bottom 0.152: v39.85,43.51 39.85,42.98 40.54,42.29 41.15,42.29 48.62,49.76 48.62,49.91 51.13,52.43 52.43,52.43 54.71,54.71 v54.71,63.63 | v54.71,66.22 54.71,67.74 56.39,69.42 56.39,70.26 55.24,71.4 53.42,71.4 52.81,72.01 52.81,78.26 54.56,80.01 OTA3.4
N$56  (via drill 0.35)
  Top 0.152: R49.2 46.86,11.43 48.08,10.21 51.97,10.21 59.66,17.91 v59.66,22.63 | v64.01,68.5 64.01,78.26 62.26,80.01 OTA3.13
  Bottom 0.152: v59.66,22.63 59.66,24.38 61.04,25.76 61.04,27.96 62.56,29.49 62.56,40.92 64.01,42.37 v64.01,68.5
N$57  (via drill 0.35)
  Top 0.152: R50.1 26.67,10.13 30.71,14.17 30.71,25.38 36.2,30.86 36.2,38.71 37.8,40.31 37.8,42.29 38.41,42.9 v40.84,42.9
  Bottom 0.152: v40.84,42.9 51.13,53.19 51.13,60.05 52.05,60.96 R22.2 52.12,60.96 52.12,62.41 58.06,68.35 58.06,78.03 62.18,82.14 62.18,82.53 OTA3.14
N$58
  Top 0.152: 54.29,28.92 54.03,29.18 53.34,29.18 R39.1 | 54.29,28.92 61.57,21.64 62.18,21.64 LED3.C | 54.29,28.92 55.47,30.1 55.55,30.1 62.26,36.8 63.48,36.8 R42.2
N$66
  Top 0.152: R45.1 55.85,39.4 50.14,39.4 46.02,43.51 41.6,43.51 39.01,46.1 31.32,46.1 30.48,46.94 C7.1
OUTA  (via drill 0.35)
  Top 0.152: v49.23,47.93 38.33,47.93 37.41,47.02 35.59,47.02 C7.2 | v60.27,63.86 64.62,68.2 64.62,90.37 58.45,96.55 U$5.P$1
  Bottom 0.152: v49.23,47.93 51.13,49.84 51.13,50.67 55.78,55.32 55.78,60.81 58.83,63.86 v60.27,63.86
OUTAB
  Top 0.152: C12.2 50.75,49.53 54.63,53.42 58.37,53.42 U$9.P$1
OUTB
  Top 0.152: C11.2 57.23,3.81 58.37,2.67 U$6.P$1